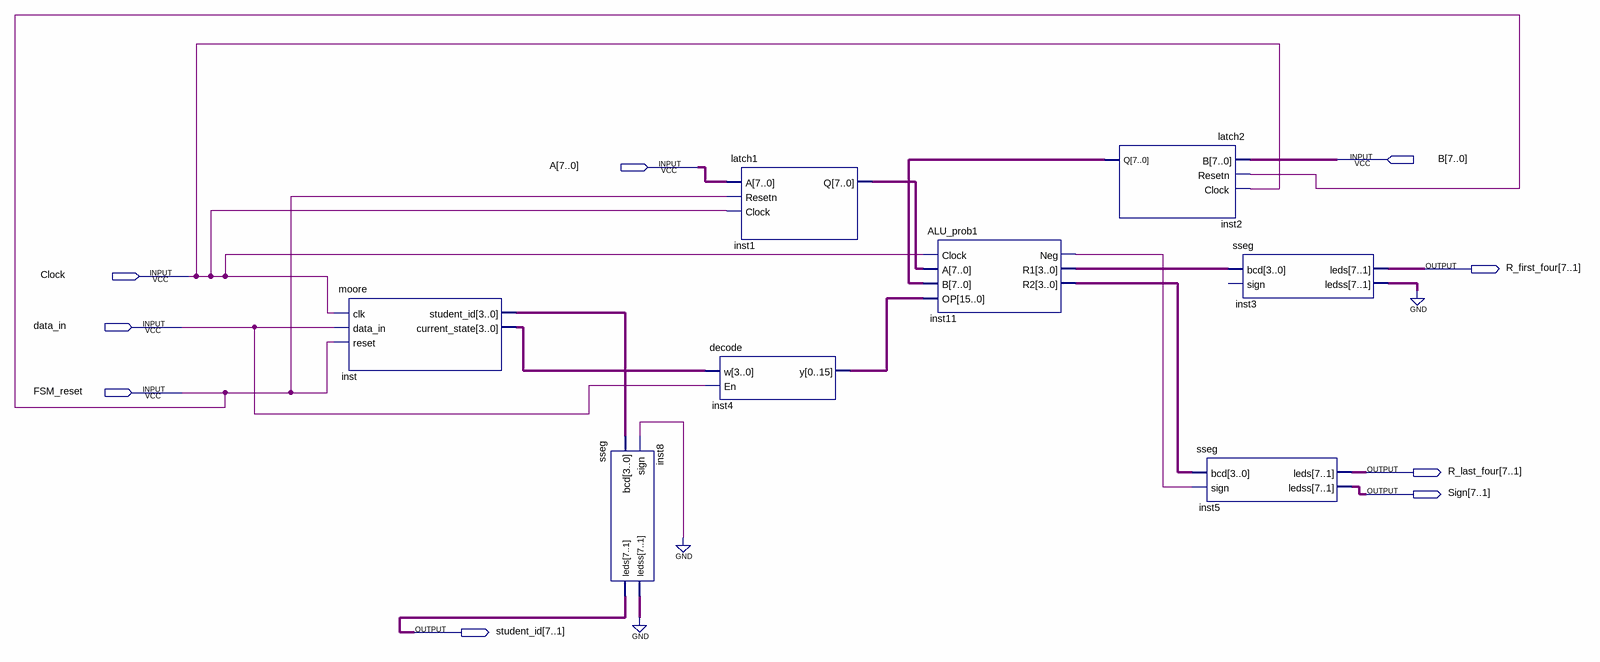
[diagram p0: schematic sheet]
// Quartus schematic prob1.bdf as structural Verilog: 8 symbols, 9 pins
module prob1 (
  input  [7:0] B,
  input  [7:0] A,
  input  Clock,
  input  data_in,
  input  FSM_reset,
  output [7:1] R_first_four,
  output [7:1] R_last_four,
  output [7:1] Sign,
  output [7:1] student_id
);

  wire inst11_neg;
  wire [3:0] inst11_r1, inst11_r2, inst_current_state, inst_student_id;
  wire [6:0] inst3_ledss, inst8_ledss;
  wire [7:0] inst1_q, inst2_q;
  wire [15:0] inst4_y;

  moore inst (
    .clk(Clock), .data_in(data_in), .reset(FSM_reset), .student_id(inst_student_id),
    .current_state(inst_current_state));
  sseg inst8 (.bcd(inst_student_id), .sign(1'b0), .leds(student_id), .ledss(inst8_ledss));
  latch1 inst1 (.A(A), .Resetn(FSM_reset), .Clock(Clock), .Q(inst1_q));
  decode inst4 (.w(inst_current_state), .En(data_in), .y(inst4_y));
  ALU_prob1 inst11 (
    .Clock(Clock), .A(inst1_q), .B(inst2_q), .OP(inst4_y), .Neg(inst11_neg), .R1(inst11_r1), .R2(inst11_r2));
  latch2 inst2 (.B(B), .Resetn(FSM_reset), .Clock(Clock), .Q(inst2_q));
  sseg inst5 (.bcd(inst11_r2), .sign(inst11_neg), .leds(R_last_four), .ledss(Sign));
  sseg inst3 (.bcd(inst11_r1), .leds(R_first_four), .ledss(inst3_ledss));  // open: sign
  // also tied to GND on the sheet: {inst3_ledss[0], inst3_ledss[1], inst3_ledss[2], inst3_ledss[3], inst3_ledss[4], inst3_ledss[5], inst3_ledss[6], inst8_ledss[0], inst8_ledss[1], inst8_ledss[2], inst8_ledss[3], inst8_ledss[4], inst8_ledss[5], inst8_ledss[6]}
endmodule
